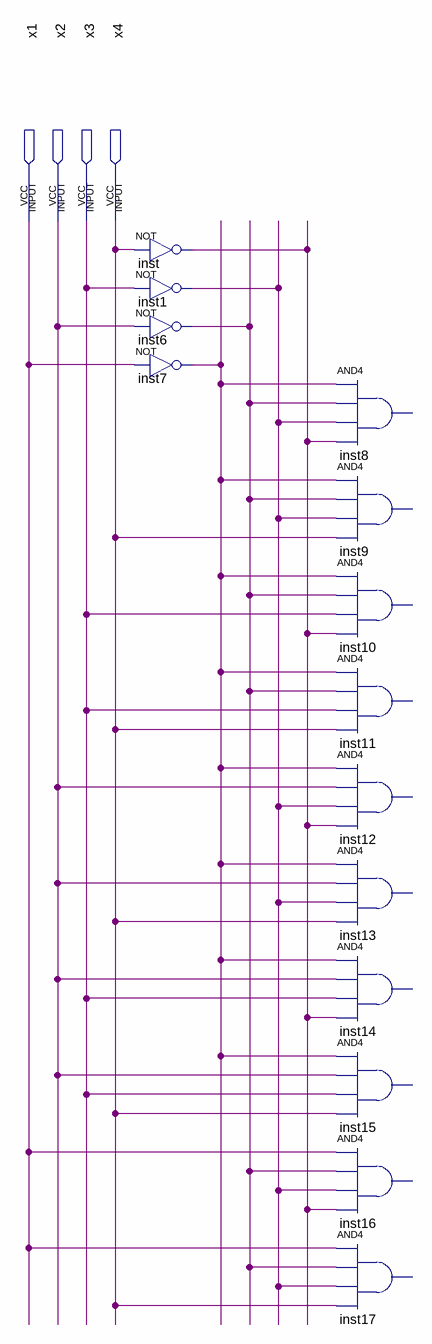
[diagram p0: schematic sheet]
// Quartus schematic temp.bdf as structural Verilog: 14 symbols, 4 pins
module temp (
  input  x1,
  input  x2,
  input  x3,
  input  x4
);

  wire inst1_out, inst6_out, inst7_out, inst_out;

  not inst (inst_out, x4);
  not inst1 (inst1_out, x3);
  not inst6 (inst6_out, x2);
  not inst7 (inst7_out, x1);
  // AND4 inst8 has open pins: IN1=inst7_out, IN2=inst6_out, IN3=inst1_out, IN4=inst_out, OUT=open
  // AND4 inst9 has open pins: IN1=inst7_out, IN2=inst6_out, IN3=inst1_out, IN4=x4, OUT=open
  // AND4 inst10 has open pins: IN1=inst7_out, IN2=inst6_out, IN3=x3, IN4=inst_out, OUT=open
  // AND4 inst11 has open pins: IN1=inst7_out, IN2=inst6_out, IN3=x3, IN4=x4, OUT=open
  // AND4 inst12 has open pins: IN1=inst7_out, IN2=x2, IN3=inst1_out, IN4=inst_out, OUT=open
  // AND4 inst13 has open pins: IN1=inst7_out, IN2=x2, IN3=inst1_out, IN4=x4, OUT=open
  // AND4 inst14 has open pins: IN1=inst7_out, IN2=x2, IN3=x3, IN4=inst_out, OUT=open
  // AND4 inst15 has open pins: IN1=inst7_out, IN2=x2, IN3=x3, IN4=x4, OUT=open
  // AND4 inst16 has open pins: IN1=x1, IN2=inst6_out, IN3=inst1_out, IN4=inst_out, OUT=open
  // AND4 inst17 has open pins: IN1=x1, IN2=inst6_out, IN3=inst1_out, IN4=x4, OUT=open
endmodule
